# EAGLE design board (EAGLE 7.4.0)
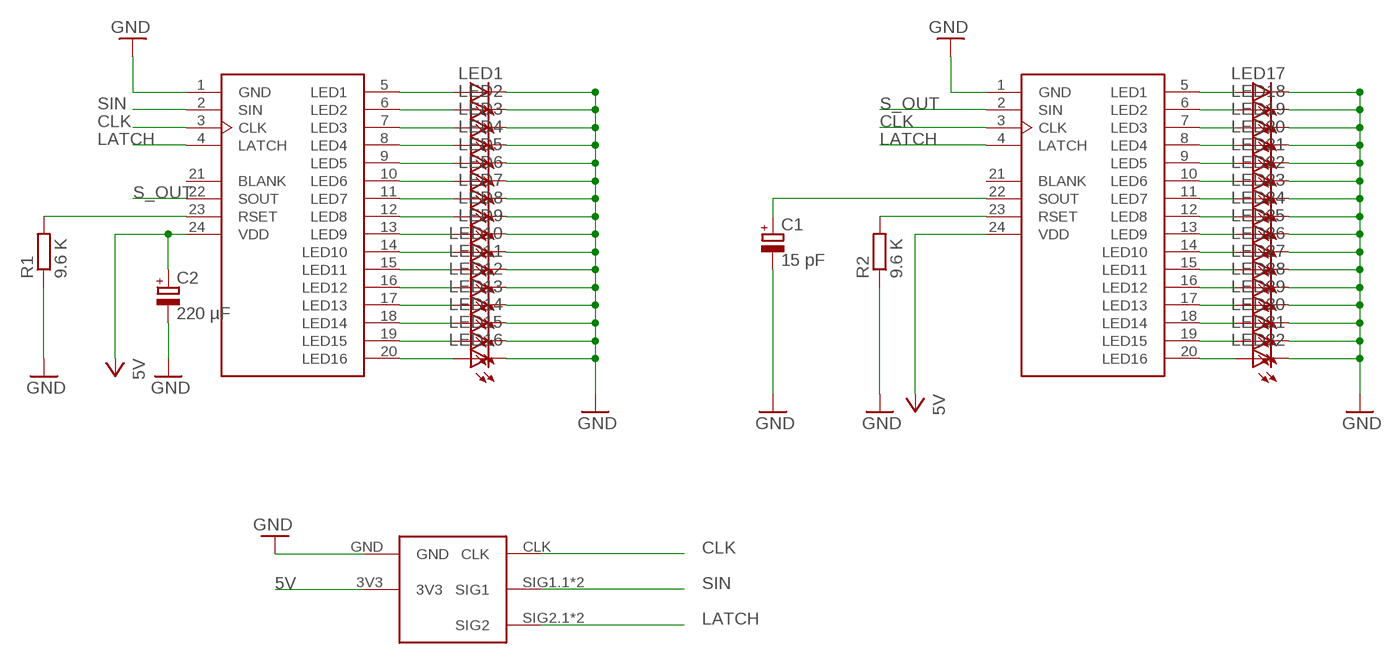
[diagram p0: schematic, sheet 1]

## Parts
C1  15 pF  CPOL-EUE5-8.5  [E5-8,5]
C2  220 µF  CPOL-EUE5-8.5  [E5-8,5]
IC1  CAT4016  [SOIC24W]
IC2  CAT4016  [SOIC24W]
LED1  LEDCHIPLED-0603-TTW  [CHIPLED-0603-TTW]
LED2  LEDCHIPLED-0603-TTW  [CHIPLED-0603-TTW]
LED3  LEDCHIPLED-0603-TTW  [CHIPLED-0603-TTW]
LED4  LEDCHIPLED-0603-TTW  [CHIPLED-0603-TTW]
LED5  LEDCHIPLED-0603-TTW  [CHIPLED-0603-TTW]
LED6  LEDCHIPLED-0603-TTW  [CHIPLED-0603-TTW]
LED7  LEDCHIPLED-0603-TTW  [CHIPLED-0603-TTW]
LED8  LEDCHIPLED-0603-TTW  [CHIPLED-0603-TTW]
LED9  LEDCHIPLED-0603-TTW  [CHIPLED-0603-TTW]
LED10  LEDCHIPLED-0603-TTW  [CHIPLED-0603-TTW]
LED11  LEDCHIPLED-0603-TTW  [CHIPLED-0603-TTW]
LED12  LEDCHIPLED-0603-TTW  [CHIPLED-0603-TTW]
LED13  LEDCHIPLED-0603-TTW  [CHIPLED-0603-TTW]
LED14  LEDCHIPLED-0603-TTW  [CHIPLED-0603-TTW]
LED15  LEDCHIPLED-0603-TTW  [CHIPLED-0603-TTW]
LED16  LEDCHIPLED-0603-TTW  [CHIPLED-0603-TTW]
LED17  LEDCHIPLED-0603-TTW  [CHIPLED-0603-TTW]
LED18  LEDCHIPLED-0603-TTW  [CHIPLED-0603-TTW]
LED19  LEDCHIPLED-0603-TTW  [CHIPLED-0603-TTW]
LED20  LEDCHIPLED-0603-TTW  [CHIPLED-0603-TTW]
LED21  LEDCHIPLED-0603-TTW  [CHIPLED-0603-TTW]
LED22  LEDCHIPLED-0603-TTW  [CHIPLED-0603-TTW]
LED23  LEDCHIPLED-0603-TTW  [CHIPLED-0603-TTW]
LED24  LEDCHIPLED-0603-TTW  [CHIPLED-0603-TTW]
LED25  LEDCHIPLED-0603-TTW  [CHIPLED-0603-TTW]
LED26  LEDCHIPLED-0603-TTW  [CHIPLED-0603-TTW]
LED27  LEDCHIPLED-0603-TTW  [CHIPLED-0603-TTW]
LED28  LEDCHIPLED-0603-TTW  [CHIPLED-0603-TTW]
LED29  LEDCHIPLED-0603-TTW  [CHIPLED-0603-TTW]
LED30  LEDCHIPLED-0603-TTW  [CHIPLED-0603-TTW]
LED31  LEDCHIPLED-0603-TTW  [CHIPLED-0603-TTW]
LED32  LEDCHIPLED-0603-TTW  [CHIPLED-0603-TTW]
R1  9.6 K  R-EU_0207/10  [0207/10]
R2  9.6 K  R-EU_0207/10  [0207/10]
U$1  SLIP-RING-INVERSE  [SLIP-RING-INVERSE]

## Nets
5V: C2.+ IC1.24(VDD) IC2.24(VDD) U$1.3V3
C1: C1.+ IC2.22(SOUT)
CLK: IC1.3(CLK) IC2.3(CLK) U$1.CLK
LATCH: IC1.4(LATCH) IC2.4(LATCH) U$1.SIG2.1(SIG2) U$1.SIG2.2(SIG2)
N$1: IC1.23(RSET) R1.2
N$2: IC2.23(RSET) R2.2
N$3: IC2.20(LED16) LED32.A@1(A)
N$4: IC2.19(LED15) LED31.A@1(A)
N$5: IC2.18(LED14) LED30.A@1(A)
N$6: IC2.17(LED13) LED29.A@1(A)
N$7: IC2.16(LED12) LED28.A@1(A)
N$8: IC2.15(LED11) LED27.A@1(A)
N$9: IC2.14(LED10) LED26.A@1(A)
N$10: IC2.13(LED9) LED25.A@1(A)
N$11: IC2.5(LED1) LED17.A@1(A)
N$12: IC2.6(LED2) LED18.A@1(A)
N$13: IC2.7(LED3) LED19.A@1(A)
N$14: IC2.8(LED4) LED20.A@1(A)
N$15: IC2.9(LED5) LED21.A@1(A)
N$16: IC2.10(LED6) LED22.A@1(A)
N$17: IC2.11(LED7) LED23.A@1(A)
N$18: IC2.12(LED8) LED24.A@1(A)
N$19: IC1.5(LED1) LED1.A@1(A)
N$20: IC1.6(LED2) LED2.A@1(A)
N$21: IC1.7(LED3) LED3.A@1(A)
N$22: IC1.8(LED4) LED4.A@1(A)
N$23: IC1.9(LED5) LED5.A@1(A)
N$24: IC1.10(LED6) LED6.A@1(A)
N$25: IC1.11(LED7) LED7.A@1(A)
N$26: IC1.12(LED8) LED8.A@1(A)
N$27: IC1.13(LED9) LED9.A@1(A)
N$28: IC1.14(LED10) LED10.A@1(A)
N$29: IC1.15(LED11) LED11.A@1(A)
N$30: IC1.16(LED12) LED12.A@1(A)
N$31: IC1.17(LED13) LED13.A@1(A)
N$32: IC1.18(LED14) LED14.A@1(A)
N$33: IC1.19(LED15) LED15.A@1(A)
N$34: IC1.20(LED16) LED16.A@1(A)
N$39: C1.- C2.- IC1.1(GND) IC2.1(GND) LED1.C@1(C) LED2.C@1(C) LED3.C@1(C) LED4.C@1(C) LED5.C@1(C) LED6.C@1(C) LED7.C@1(C) LED8.C@1(C) LED9.C@1(C) LED10.C@1(C) LED11.C@1(C) LED12.C@1(C) LED13.C@1(C) LED14.C@1(C) LED15.C@1(C) LED16.C@1(C) LED17.C@1(C) LED18.C@1(C) LED19.C@1(C) LED20.C@1(C) LED21.C@1(C) LED22.C@1(C) LED23.C@1(C) LED24.C@1(C) LED25.C@1(C) LED26.C@1(C) LED27.C@1(C) LED28.C@1(C) LED29.C@1(C) LED30.C@1(C) LED31.C@1(C) LED32.C@1(C) R1.1 R2.1 U$1.GND ; supply symbol labelled GND
S_OUT: IC1.22(SOUT) IC2.2(SIN)
SIN: IC1.2(SIN) U$1.SIG1.1(SIG1) U$1.SIG1.2(SIG1)
Unconnected: IC1.21(BLANK) IC2.21(BLANK)

## Library data of the parts
C1 C2 = rcl:CPOL-EU: POLARIZED CAPACITOR, European symbol
IC1 IC2 = cat4016:CAT4016: 16-Channel Constant Current LED Driver
LED1-LED32 = led:LED: LED OSRAM: - CHIPLED LG R971, LG N971, LY N971, LG Q971, LY Q971, LO R971, LY R971 LH N974, LH R974 LS Q976, LO Q976, LY Q976 LO Q996 - Hyper CHIPLED LW Q18S LB Q993, LB Q99A, LB R99A - SideLED LS A670, LO A670, LY A670, LG A670, LP A670 LB A673, LV A673, LT A673, LW A673 LH A674 LY A675 LS A676, LA A676, LO A676, LY A676, LW A676 LS A679, LY A679, LG A679 - Hyper Micro SIDELED® LS Y876, LA Y876, LO Y876, LY Y876 LT Y87S - SmartLED LW L88C, LW L88S LB L89C, LB L89S, LG L890 LS L89K, LO L89K, LY L89K LS L896, LA L896, LO L896, LY L896 - TOPLED LS T670, LO T670, LY T670, LG T670, LP T670 LSG T670, LSP T670, LSY T670, LOP T670, LYG T670 LG T671, LOG T671, LSG T671 LB T673, LV T673, LT T673, LW T673 LH T674 LS T676, LA T676, LO T676, LY T676, LB T676, LH T676, LSB T676, LW T676 LB T67C, LV T67C, LT T67C, LS T67K, LO T67K, LY T67K, LW E67C LS E67B, LA E67B, LO E67B, LY E67B, LB E67C, LV E67C, LT E67C LW T67C LS T679, LY T679, LG T679 LS T770, LO T770, LY T770, LG T770, LP T770 LB T773, LV T773, LT T773, LW T773 LH T774 LS E675, LA E675, LY E675, LS T675 LS T776, LA T776, LO T776, LY T776, LB T776 LHGB T686 LT T68C, LB T68C - Hyper Mini TOPLED® LB M676 - Mini TOPLED Santana® LG M470 LS M47K, LO M47K, LY M47K Source: http://www.osram.convergy.de LUXEON: - LUMILED® LXK2-PW12-R00, LXK2-PW12-S00, LXK2-PW14-U00, LXK2-PW14-V00 LXK2-PM12-R00, LXK2-PM12-S00, LXK2-PM14-U00 LXK2-PE12-Q00, LXK2-PE12-R00, LXK2-PE12-S00, LXK2-PE14-T00, LXK2-PE14-U00 LXK2-PB12-K00, LXK2-PB12-L00, LXK2-PB12-M00, LXK2-PB14-N00, LXK2-PB14-P00, LXK2-PB14-Q00 LXK2-PR12-L00, LXK2-PR12-M00, LXK2-PR14-Q00, LXK2-PR14-R00 LXK2-PD12-Q00, LXK2-PD12-R00, LXK2-PD12-S00 LXK2-PH12-R00, LXK2-PH12-S00 LXK2-PL12-P00, LXK2-PL12-Q00, LXK2-PL12-R00 Source: www.luxeon.com KINGBRIGHT: KA-3528ASYC Source: www.kingbright.com
R1 R2 = resistor:R-EU_: RESISTOR, European symbol
U$1 = slip_ring:SLIP-RING-INVERSE

## Board
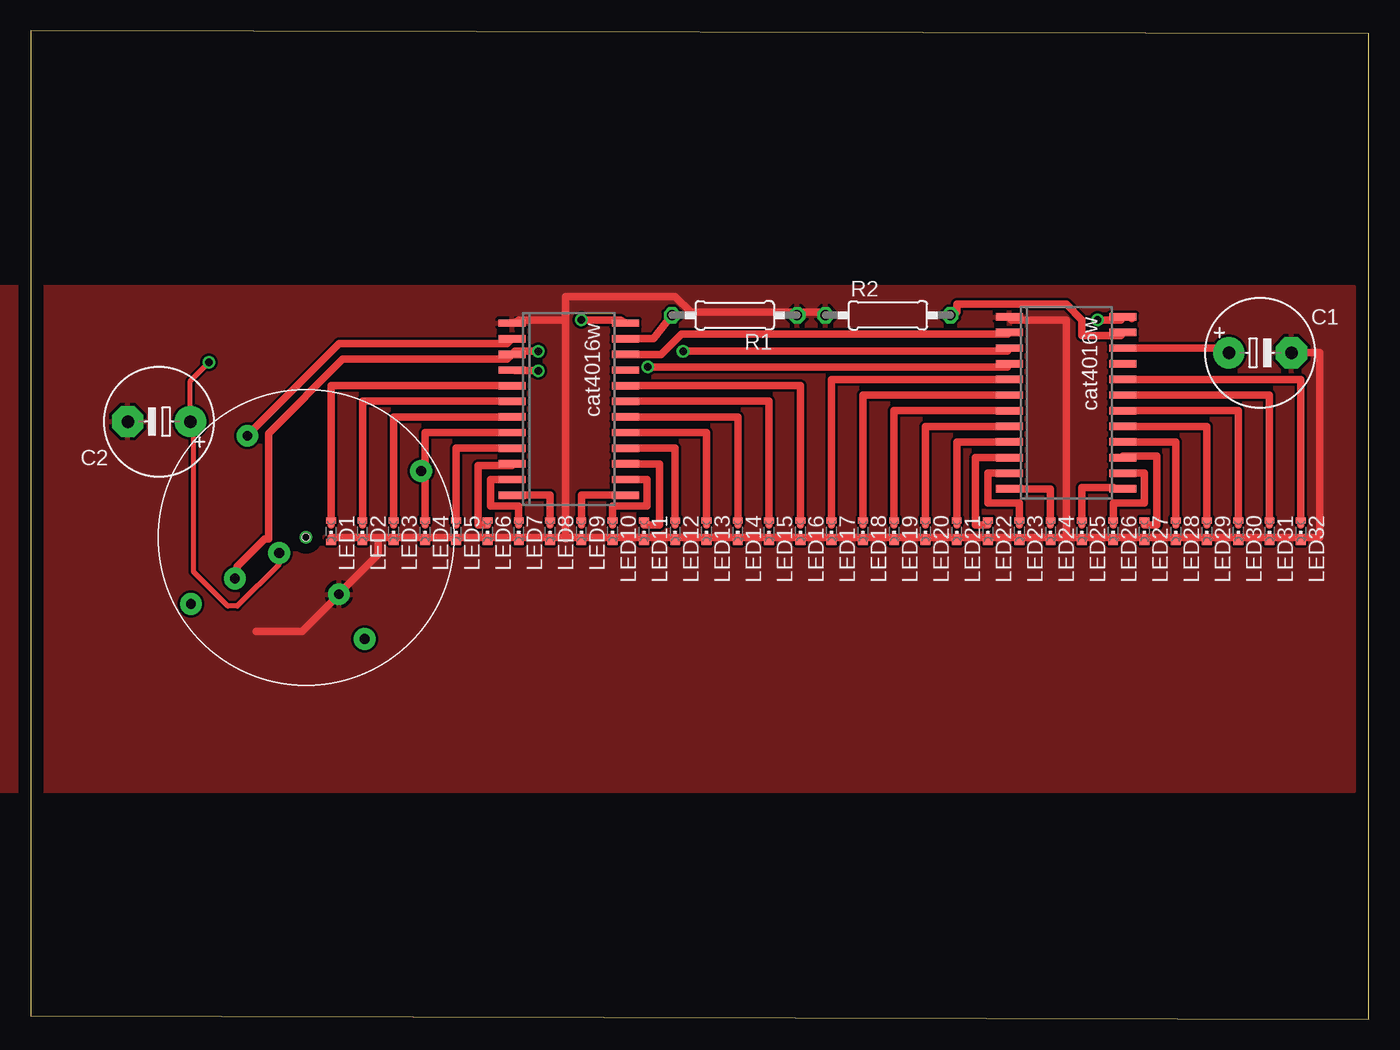
[diagram p1: board, top side]
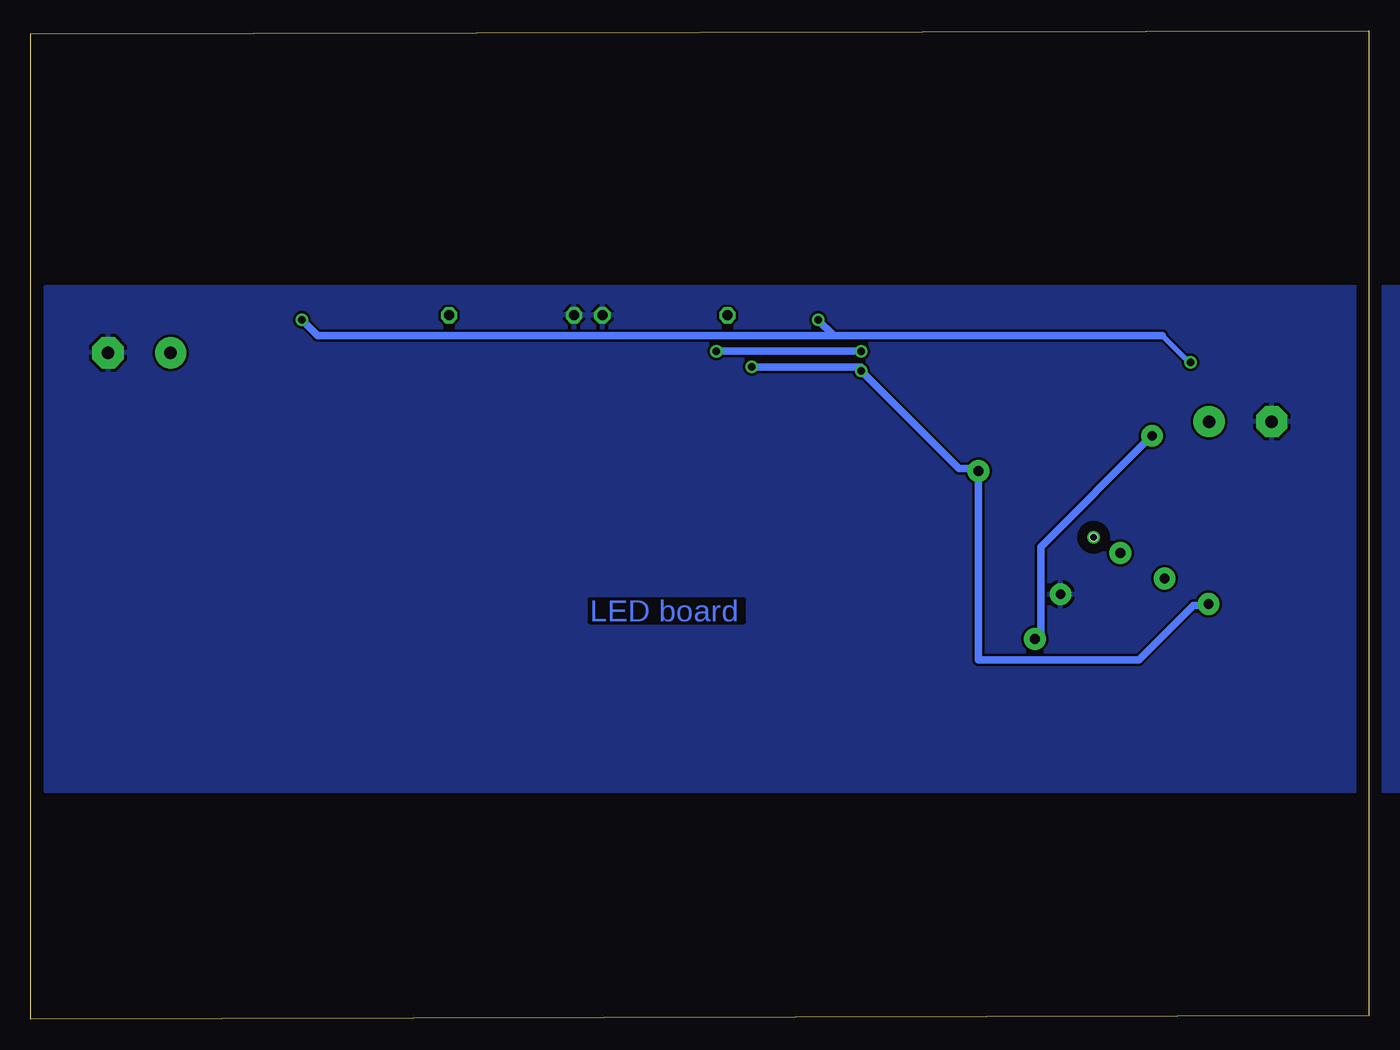
[diagram p2: board, bottom side, seen from below]

Size 108.64 x 80.25 mm. Coordinates in mm from the lower left corner, seen from the top.
Outline: 0,0.25 108.64,0 108.64,80 0,80.25 0,0.25
Copper layers (1*16): Top 0.035mm / dielectric 1.5mm / Bottom 0.035mm
Design rules "default *": minimum track width 24mil, minimum drill 24mil, track to track 8mil, track to pad 8mil, pad to pad 8mil, via to via 8mil, smd to smd 8mil, copper to edge 40mil, drill to drill 8mil, minimum pad ring 10mil, minimum via ring 8mil, stop-mask expansion 4mil, vias tented up to drill 0mil, thermal gap 10mil

### Footprints (pad centres in the part's own frame; a part is rotated, then mirrored left to right if it is on the bottom)
E5-8,5 = drill 1.016 pad 2.54: + -2.54,0 | drill 1.016 pad 2.54 octagon: - 2.54,0
SOIC24W = smd 0.6 x 2.2: 1 -6.985,-4.6; 2 -5.715,-4.6; 3 -4.445,-4.6; 4 -3.175,-4.6; 5 -1.905,-4.6; 6 -0.635,-4.6; 7 0.635,-4.6; 8 1.905,-4.6; 9 3.175,-4.6; 10 4.445,-4.6; 11 5.715,-4.6; 12 6.985,-4.6; 13 6.985,4.6; 14 5.715,4.6; 15 4.445,4.6; 16 3.175,4.6; 17 1.905,4.6; 18 0.635,4.6; 19 -0.635,4.6; 20 -1.905,4.6; 21 -3.175,4.6; 22 -4.445,4.6; 23 -5.715,4.6; 24 -6.985,4.6
CHIPLED-0603-TTW = smd 0.8 x 0.5: A 0,-0.875; C 0,0.875 | smd 0.35 x 0.35: A@1 0,-0.5; C@1 0,0.5
0207/10 = drill 0.813 octagon: 1 -5.08,0; 2 5.08,0
SLIP-RING-INVERSE = drill 0.8 pad 1.778: 3V3 2.54,0; CLK 6.668,0; GND 0,5.334; SIG1.1 0,9.525; SIG1.2 0,-9.525; SIG2.1 -10.795,0; SIG2.2 10.795,0 | hole 0.6: 0,0

### Placement (x,y rotation side)
C1  99.82,54.1 0 top
C2  10.41,48.51 180 top
IC1  43.69,49.53 270 top
IC2  84.07,50.04 270 top
LED1  24.38,39.62 180 top
LED2  26.92,39.62 180 top
LED3  29.46,39.62 180 top
LED4  32,39.62 180 top
LED5  34.54,39.62 180 top
LED6  37.08,39.62 180 top
LED7  39.62,39.62 180 top
LED8  42.16,39.62 180 top
LED9  44.7,39.62 180 top
LED10  47.24,39.62 180 top
LED11  49.78,39.62 180 top
LED12  52.32,39.62 180 top
LED13  54.86,39.62 180 top
LED14  57.4,39.62 180 top
LED15  59.94,39.62 180 top
LED16  62.48,39.62 180 top
LED17  65.02,39.62 180 top
LED18  67.56,39.62 180 top
LED19  70.1,39.62 180 top
LED20  72.64,39.62 180 top
LED21  75.18,39.62 180 top
LED22  77.72,39.62 180 top
LED23  80.26,39.62 180 top
LED24  82.8,39.62 180 top
LED25  85.34,39.62 180 top
LED26  87.88,39.62 180 top
LED27  90.42,39.62 180 top
LED28  92.96,39.62 180 top
LED29  95.5,39.62 180 top
LED30  98.04,39.62 180 top
LED31  100.58,39.62 180 top
LED32  103.12,39.62 180 top
R1  57.15,57.15 180 top
R2  69.6,57.15 0 top
U$1  22.35,39.12 210 top

### Tracks (layer width: path | path; a pad name or v marks a point on that pad's centre or on a via)
5V  (via drill 0.6, 0.61)
  Top 0.406: U$1.3V3 20.15,36.92 16.76,33.53 16,33.53 13.21,36.32 13.21,48.26 C2.+ 12.95,51.82 v14.48,53.34
  Top 0.61: IC2.24 88.9,57.02 | IC2.24 89.41,57.02 89.41,56.9 | v44.7,56.77 47.88,56.77 IC1.24 | v86.61,56.77 88.52,56.77 IC2.24
  Bottom 0.406: v14.48,53.34 14.61,53.34 16.76,55.5
  Bottom 0.61: 43.43,55.5 v44.7,56.77 | 16.76,55.5 43.43,55.5 | v86.61,56.77 85.34,55.5 43.43,55.5
C1
  Top 0.61: IC2.22 97.28,54.48 C1.+
CLK  (via drill 0.61)
  Top 0.61: U$1.CLK 16.76,35.81 16.76,36.77 18.99,38.99 19.3,38.99 19.3,47.56 25.34,53.59 38.67,53.59 38.99,53.91 IC1.3 39.31,54.23 v41.21,54.23 | v52.96,54.23 79.31,54.23 IC2.3
  Bottom 0.61: v41.21,54.23 v52.96,54.23
LATCH  (via drill 0.61)
  Top 0.61: v41.21,52.64 39.31,52.64 IC1.4 | v50.1,52.96 79.31,52.96 IC2.4
  Bottom 0.61: v50.1,52.96 41.21,52.96 v41.21,52.64 33.27,44.7 32,44.7 U$1.SIG2.1 31.69,44.39 31.69,29.15 18.67,29.15 14.22,33.59 13.27,33.59 U$1.SIG2.2
N$1
  Top 0.61: IC1.23 50.55,55.24 R1.2
N$2
  Top 0.61: IC2.23 88.52,55.5 85.34,55.5 85.34,56.77 84.07,58.04 75.18,58.04 75.18,57.4 R2.2
N$3
  Top 0.61: IC2.20 103.12,51.94 LED32.A@1
N$4
  Top 0.61: IC2.19 100.58,50.67 LED31.A@1
N$5
  Top 0.61: IC2.18 98.04,49.4 LED30.A@1
N$6
  Top 0.61: IC2.17 95.5,48.13 LED29.A@1
N$7
  Top 0.61: IC2.16 92.96,46.86 LED28.A@1
N$8
  Top 0.61: LED27.A@1 91.44,40.12 91.44,45.72 88.67,45.72 IC2.15
N$9
  Top 0.61: IC2.14 90.42,44.32 90.42,41.91 87.88,41.91 LED26.A@1
N$10
  Top 0.61: IC2.13 87.88,43.05 87.88,43.18 85.34,43.18 LED25.A@1
N$11
  Top 0.61: IC2.5 65.02,51.94 LED17.A@1
N$12
  Top 0.61: IC2.6 67.56,50.67 LED18.A@1
N$13
  Top 0.61: IC2.7 70.1,49.4 LED19.A@1
N$14
  Top 0.61: IC2.8 72.64,48.13 LED20.A@1
N$15
  Top 0.61: IC2.9 75.18,46.86 LED21.A@1
N$16
  Top 0.61: IC2.10 76.71,45.59 76.71,40.13 LED22.A@1
N$17
  Top 0.61: IC2.11 77.72,44.32 77.72,41.91 80.26,41.91 LED23.A@1
N$18
  Top 0.61: IC2.12 82.8,43.05 LED24.A@1
N$19
  Top 0.61: IC1.5 24.38,51.43 LED1.A@1
N$20
  Top 0.61: IC1.6 26.92,50.16 LED2.A@1
N$21
  Top 0.61: IC1.7 29.46,48.89 LED3.A@1
N$22
  Top 0.61: IC1.8 32,47.62 LED4.A@1
N$23
  Top 0.61: IC1.9 34.54,46.35 LED5.A@1
N$24
  Top 0.61: LED6.A@1 36.32,40.12 36.32,44.96 39.09,44.96 IC1.10
N$25
  Top 0.61: IC1.11 37.34,43.81 37.34,41.66 39.62,41.66 LED7.A@1
N$26
  Top 0.61: IC1.12 42.16,42.54 LED8.A@1
N$27
  Top 0.61: IC1.13 44.7,42.54 LED9.A@1
N$28
  Top 0.61: IC1.14 50.04,43.81 50.04,41.66 47.24,41.66 LED10.A@1
N$29
  Top 0.61: IC1.15 51.05,45.09 51.05,40.13 LED11.A@1
N$30
  Top 0.61: IC1.16 52.32,46.35 LED12.A@1
N$31
  Top 0.61: IC1.17 54.86,47.62 LED13.A@1
N$32
  Top 0.61: IC1.18 57.4,48.89 LED14.A@1
N$33
  Top 0.61: IC1.19 59.94,50.16 LED15.A@1
N$34
  Top 0.61: IC1.20 62.48,51.43 LED16.A@1
N$35  (via drill 0.6)
  other vias: 14.48,53.34
N$36
  pour Bottom: 5.08,59.44 -99.06,59.44 -99.06,18.54 5.08,18.54
N$37  (via drill 0.6)
  other vias: 22.35,39.12
N$38
  pour Top: -99.06,59.44 3.05,59.44 3.05,18.54 -99.06,18.54
N$39
  Top 0.61: LED1.C@1 LED2.C@1 28.19,39.12 | 28.19,39.12 LED3.C@1 LED4.C@1 LED5.C@1 LED6.C@1 LED7.C@1 LED8.C@1 43.43,39.12 | 43.43,39.12 LED9.C@1 LED10.C@1 LED11.C@1 LED12.C@1 LED13.C@1 | LED13.C@1 55.37,39.12 LED13.C@1 | LED13.C@1 LED14.C@1 LED15.C@1 LED16.C@1 LED17.C@1 LED18.C@1 LED19.C@1 LED20.C@1 LED21.C@1 LED22.C@1 LED23.C@1 LED24.C@1 84.07,39.12 | 84.07,39.12 LED25.C@1 LED26.C@1 LED27.C@1 LED28.C@1 LED29.C@1 LED30.C@1 LED31.C@1 LED32.C@1 | 28.19,39.12 28.19,37.72 25.02,34.54 U$1.GND 22.02,31.5 18.29,31.5 | C1.- 104.65,54.1 104.65,39.12 LED32.C@1 | LED32.C@1 | R2.1 64.39,57.4 62.48,57.4 R1.1 61.85,57.4 53.59,57.4 52.32,58.67 43.43,58.67 43.43,56.77 | 43.43,56.77 39.62,56.77 IC1.1 | 43.43,39.12 43.43,56.77 | 43.43,38.99 43.43,39.12 | 84.07,39.12 84.07,56.77 79.63,56.77 IC2.1 | 84.07,38.99 84.07,39.12
  pour Top: 107.44,59.44 107.44,18.54 -99.06,18.54 -99.06,59.44
  pour Bottom: 107.44,59.44 -99.06,59.44 -99.06,18.54 107.44,18.54
S_OUT
  Top 0.61: IC2.2 79.35,55.63 52.83,55.63 51.18,53.97 IC1.22
SIN
  Top 0.61: IC1.2 38.99,55.18 38.67,54.86 25.02,54.86 17.72,47.56 U$1.SIG1.2
  Bottom 0.61: U$1.SIG1.1 26.92,31.05 26.61,31.37 26.61,38.35 17.72,47.24 U$1.SIG1.2

### Text on the board
Bottom: LED board